# Altium schematic sheet Sheet1.SchDoc
size 594 x 420 mm; Address1: Address1; Address2: Address2; Address3: Address3; Address4: Address4; SheetNumber: 2; Обозначение документа: АБВГ.123456.001 Э3; Наименование организации: ПИКС, гр. 913801; Перв. применение: АБВГ.123456.000; Наименование изделия 1: Плата; Наименование изделия 2: Схема электрическая; Наименование изделия 3: принципиальная; Нач. отд.: Нач. отд.; _List: 1; _Oboznachenie: ГУИР.467649.045 Э2; _Razrabotal: Гончар; _Proveril: Ролич; _Tip_dokumenta: Схема электрическая принципиальная; _Organizaciya2_verhnee: ПИКС, гр. 913801; _Listov: 1; _Nazvanie3_srednee: IP-Видеокамера мобильная
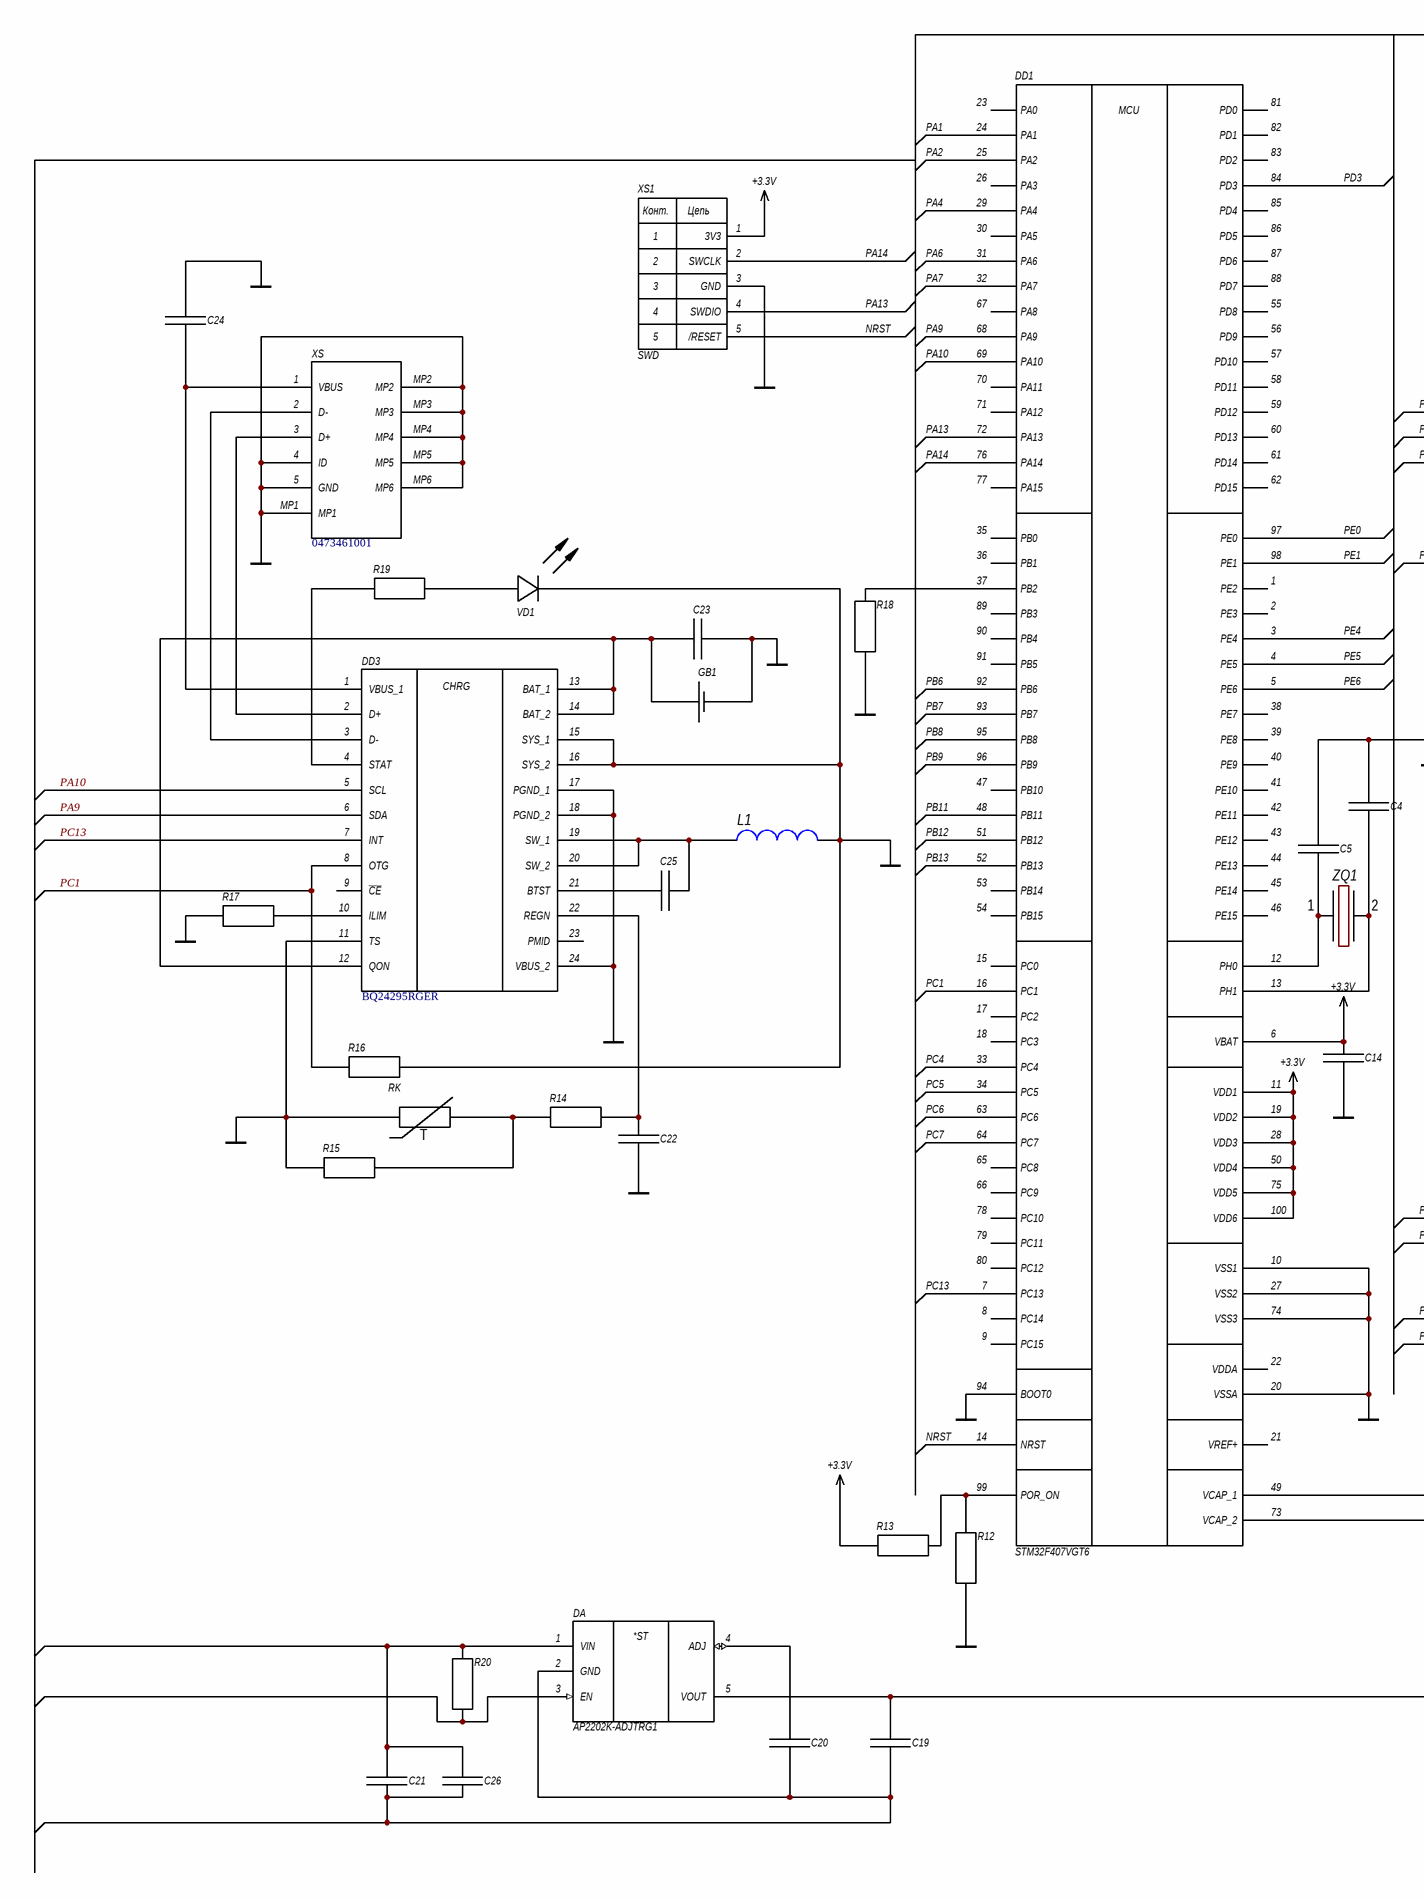
[diagram p0: Sheet1.SchDoc, left]
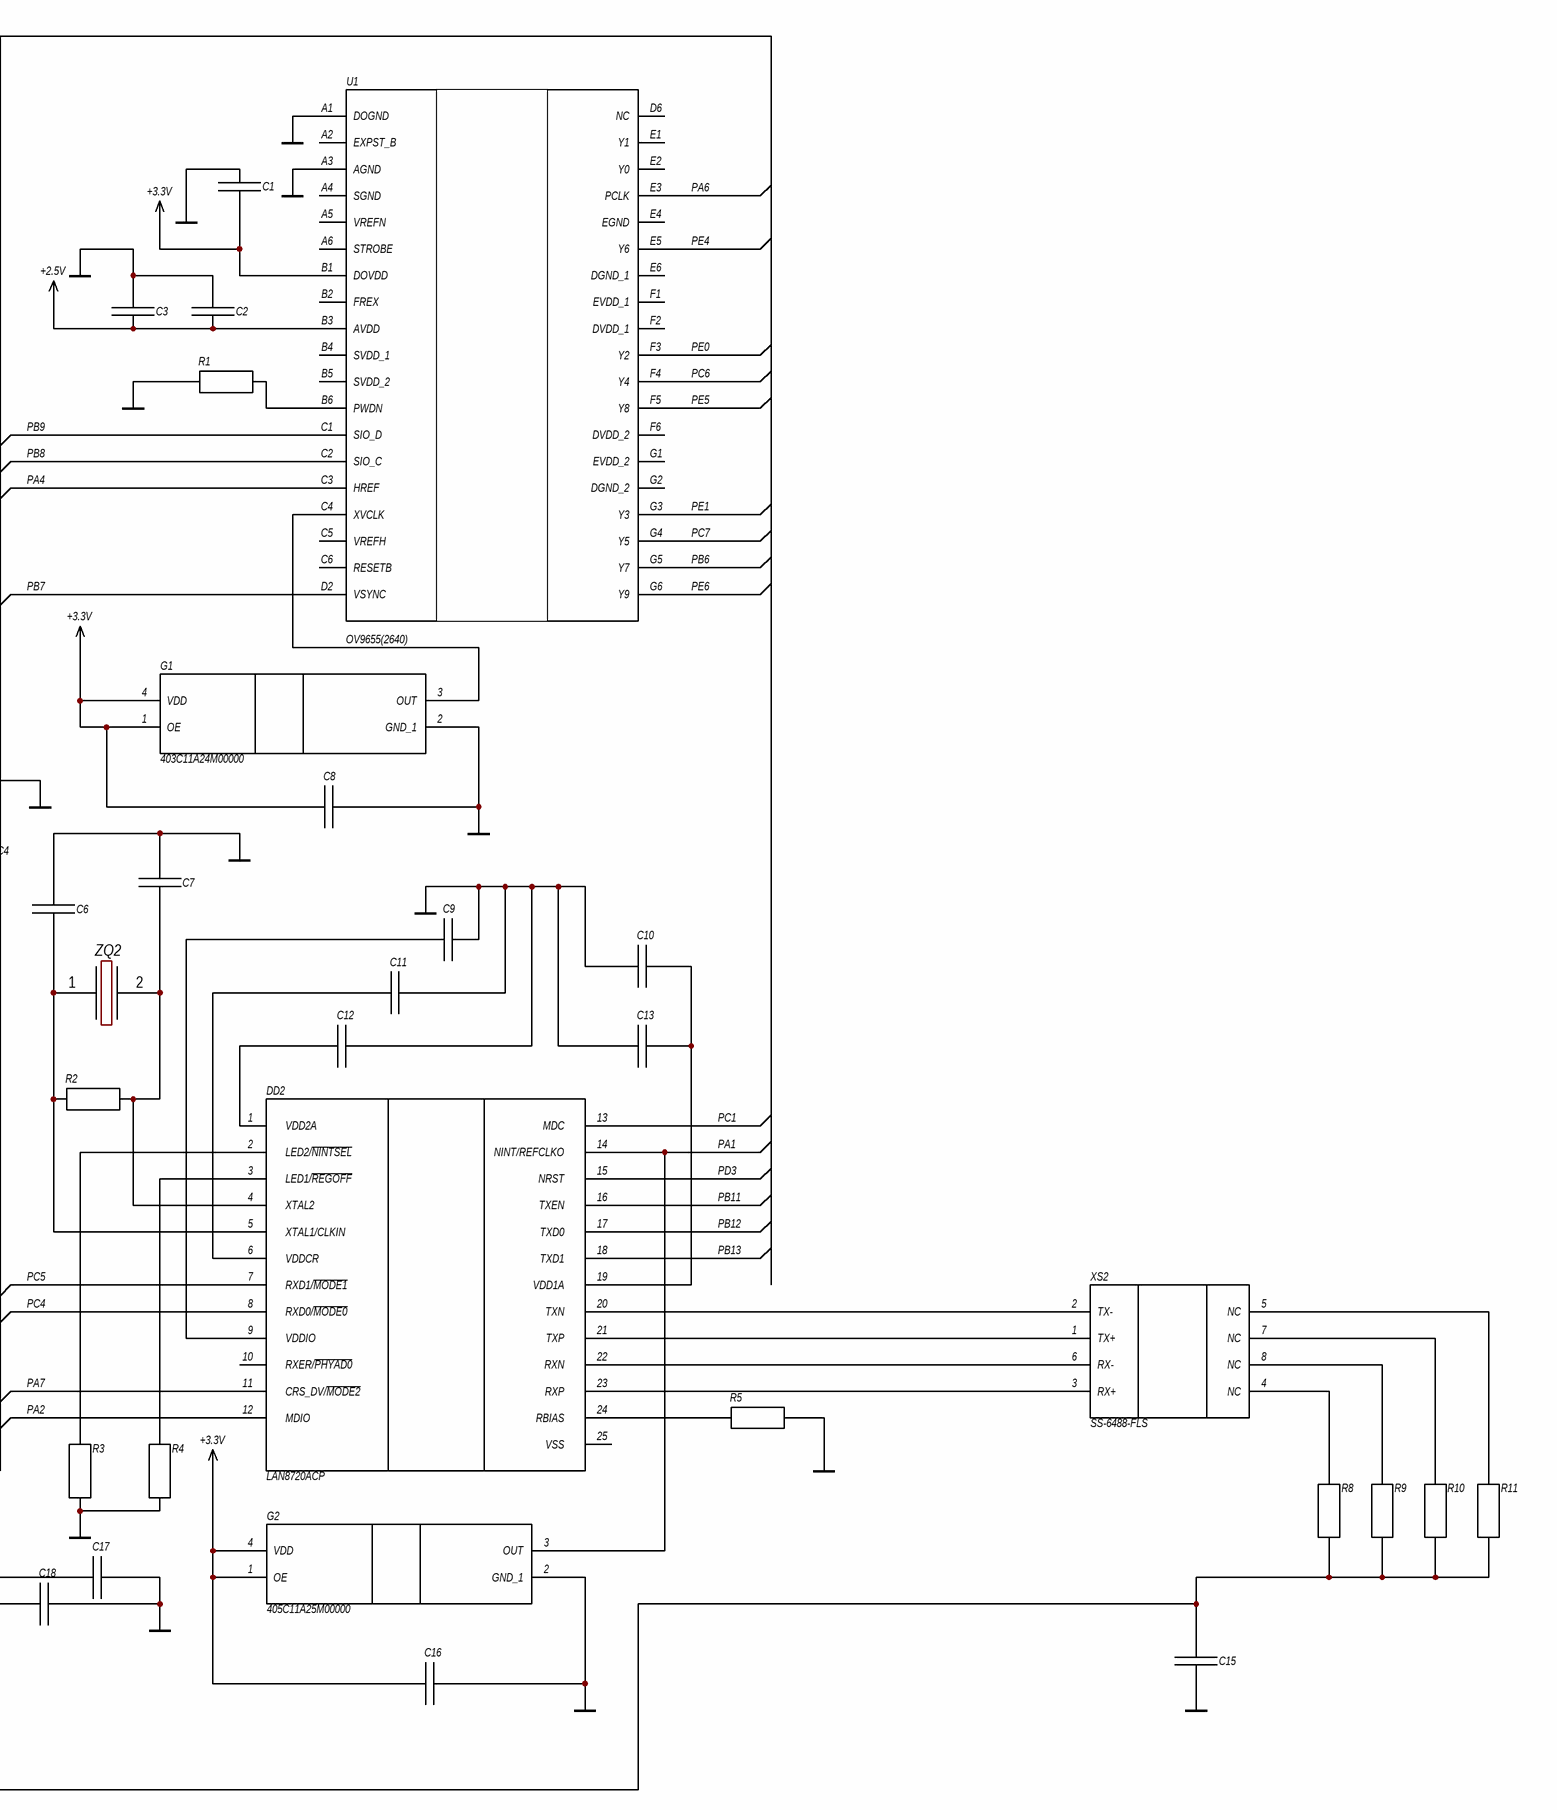
[diagram p1: Sheet1.SchDoc, right]

## Parts
C1  (no value)  [0805 (Capacitor)]
C2  (no value)  [0805 (Capacitor)]
C3  (no value)  [0805 (Capacitor)]
C4  (no value)  [0805 (Capacitor)]
C5  (no value)  [0805 (Capacitor)]
C6  (no value)  [0805 (Capacitor)]
C7  (no value)  [0805 (Capacitor)]
C8  (no value)  [0805 (Capacitor)]
C9  (no value)  [0805 (Capacitor)]
C10  (no value)  [0805 (Capacitor)]
C11  (no value)  [0805 (Capacitor)]
C12  (no value)  [0805 (Capacitor)]
C13  (no value)  [0805 (Capacitor)]
C14  (no value)  [0805 (Capacitor)]
C15  (no value)  [0805 (Capacitor)]
C16  (no value)  [0805 (Capacitor)]
C17  (no value)  [0805 (Capacitor)]
C18  (no value)  [0805 (Capacitor)]
C19  (no value)  [0805 (Capacitor)]
C20  (no value)  [0805 (Capacitor)]
C21  (no value)  [0805 (Capacitor)]
C22  (no value)  [0805 (Capacitor)]
C23  (no value)  [0805 (Capacitor)]
C24  (no value)  [0805 (Capacitor)]
C25  (no value)  [0805 (Capacitor)]
C26  (no value)  [0805 (Capacitor)]
DA  AP2202K-ADJTRG1  [SOT95P280X145-5N]
DD1  STM32F407VGT6  [QFP50P1600X1600X160-100N]
DD2  LAN8720ACP  [QFN50P400X400X100-25N-D]
DD3  BQ24295RGER  [QFN50P400X400X100-25N-D]
G1  403C11A24M00000  [403C11A20M00000]
G2  405C11A25M00000  [405C11A25M00000]
GB1  (no value)  [Battery]
L1  (no value)  [IND: SDR0604]
R1  (no value)  [0805 (Resistor)]
R2  (no value)  [0805 (Resistor)]
R3  (no value)  [0805 (Resistor)]
R4  (no value)  [0805 (Resistor)]
R5  (no value)  [0805 (Resistor)]
R8  (no value)  [0805 (Resistor)]
R9  (no value)  [0805 (Resistor)]
R10  (no value)  [0805 (Resistor)]
R11  (no value)  [0805 (Resistor)]
R12  (no value)  [0805 (Resistor)]
R13  (no value)  [0805 (Resistor)]
R14  (no value)  [0805 (Resistor)]
R15  (no value)  [0805 (Resistor)]
R16  (no value)  [0805 (Resistor)]
R17  (no value)  [0805 (Resistor)]
R18  (no value)  [0805 (Resistor)]
R19  (no value)  [0805 (Resistor)]
R20  (no value)  [0805 (Resistor)]
RK  (no value)  [0805 (Resistor)]
U1  OV9655(2640)  [BGA38C80P6X7_572X628X96]
VD1  (no value)  [LED]
XS  0473461001  [0473461001]
XS1  SWD  [SWD]
XS2  SS-6488-FLS  [SS6488FLS]
ZQ1  (no value)  [OSC: 2016]
ZQ2  (no value)  [OSC: 2016]

## Nets
+2.5V: C2.2 C3.2 U1.B3(AVDD)
+3.3V: C1.2 C8.1 C14.1 C16.1 DD1.6(VBAT) DD1.11(VDD1) DD1.19(VDD2) DD1.28(VDD3) DD1.50(VDD4) DD1.75(VDD5) DD1.100(VDD6) G1.1(OE) G1.4(VDD) G2.1(OE) G2.4(VDD) R13.2 U1.B1(DOVDD) XS1.1(3V3)
GND: C1.1 C2.1 C3.1 C4.1 C5.1 C6.1 C7.1 C8.2 C9.2 C10.1 C11.2 C12.2 C13.1 C14.2 C15.1 C16.2 C17.2 C18.2 C22.2 C23.2 C24.2 DD1.10(VSS1) DD1.20(VSSA) DD1.27(VSS2) DD1.74(VSS3) DD1.94(BOOT0) DD3.11(TS) DD3.15(SYS_1) DD3.16(SYS_2) DD3.17(PGND_1) DD3.18(PGND_2) DD3.24(VBUS_2) G1.2(GND_1) G2.2(GND_1) GB1.2 L1.1 R1.1 R3.1 R4.1 R5.2 R12.1 R15.1 R16.2 R17.1 R18.1 RK.1 U1.A1(DOGND) U1.A3(AGND) VD1.2(C) XS.4(ID) XS.5(GND) XS.MP1 XS.MP2 XS.MP3 XS.MP4 XS.MP5 XS.MP6 XS1.3(GND)
NRST: DD1.14(NRST) XS1.5(/RESET)
PA1: DD1.24(PA1) DD2.14(NINT/REFCLKO) G2.3(OUT)
PA2: DD1.25(PA2) DD2.12(MDIO)
PA4: DD1.29(PA4) U1.C3(HREF)
PA6: DD1.31(PA6) U1.E3(PCLK)
PA7: DD1.32(PA7) DD2.11(CRS_DV/~{MODE2})
PA9: DD1.68(PA9) DD3.6(SDA)
PA10: DD1.69(PA10) DD3.5(SCL)
PA13: DD1.72(PA13) XS1.4(SWDIO)
PA14: DD1.76(PA14) XS1.2(SWCLK)
PB6: DD1.92(PB6) U1.G5(Y7)
PB7: DD1.93(PB7) U1.D2(VSYNC)
PB8: DD1.95(PB8) U1.C2(SIO_C)
PB9: DD1.96(PB9) U1.C1(SIO_D)
PB11: DD1.48(PB11) DD2.16(TXEN)
PB12: DD1.51(PB12) DD2.17(TXD0)
PB13: DD1.52(PB13) DD2.18(TXD1)
PC1: DD1.16(PC1) DD2.13(MDC) DD3.8(OTG) R16.1
PC4: DD1.33(PC4) DD2.8(RXD0/~{MODE0})
PC5: DD1.34(PC5) DD2.7(RXD1/~{MODE1})
PC6: DD1.63(PC6) U1.F4(Y4)
PC7: DD1.64(PC7) U1.G4(Y5)
PC13: DD1.7(PC13) DD3.7(INT)
PD3: DD1.84(PD3) DD2.15(NRST)
PE0: DD1.97(PE0) U1.F3(Y2)
PE1: DD1.98(PE1) U1.G3(Y3)
PE4: DD1.3(PE4) U1.E5(Y6)
PE5: DD1.4(PE5) U1.F5(Y8)
PE6: DD1.5(PE6) U1.G6(Y9)
NetC4_2: C4.2 DD1.13(PH1) ZQ1.2
NetC5_2: C5.2 DD1.12(PH0) ZQ1.1
NetC6_2: C6.2 DD2.5(XTAL1/CLKIN) R2.1 ZQ2.1
NetC7_2: C7.2 DD2.4(XTAL2) R2.2 ZQ2.2
NetC9_1: C9.1 DD2.9(VDDIO)
NetC10_2: C10.2 C13.2 DD2.19(VDD1A)
NetC11_1: C11.1 DD2.6(VDDCR)
NetC12_1: C12.1 DD2.1(VDD2A)
NetC15_2: C15.2 C19.1 DA.5(VOUT) R8.1 R9.1 R10.1 R11.1
NetC17_1: C17.1 DD1.49(VCAP_1)
NetC18_1: C18.1 DD1.73(VCAP_2)
NetC19_2: C19.2 C20.2 C21.1 C26.1 DA.2(GND)
NetC20_1: C20.1 DA.4(ADJ)
NetC21_2: C21.2 C26.2 DA.1(VIN) R20.2
NetC22_1: C22.1 DD3.22(REGN) R14.2
NetC23_1: C23.1 DD3.12(QON) DD3.13(BAT_1) DD3.14(BAT_2) GB1.1
NetC24_1: C24.1 DD3.1(VBUS_1) XS.1(VBUS)
NetC25_1: C25.1 DD3.19(SW_1) DD3.20(SW_2) L1.2
NetC25_2: C25.2 DD3.21(BTST)
NetDA_3: DA.3(EN) R20.1
NetDD1_37: DD1.37(PB2) R18.2
NetDD1_99: DD1.99(POR_ON) R12.2 R13.1
NetDD2_2: DD2.2(LED2/~{NINTSEL}) R3.2
NetDD2_3: DD2.3(LED1/~{REGOFF}) R4.2
NetDD2_20: DD2.20(TXN) XS2.2(TX-)
NetDD2_21: DD2.21(TXP) XS2.1(TX+)
NetDD2_22: DD2.22(RXN) XS2.6(RX-)
NetDD2_23: DD2.23(RXP) XS2.3(RX+)
NetDD2_24: DD2.24(RBIAS) R5.1
NetDD3_2: DD3.2(D+) XS.3(D+)
NetDD3_3: DD3.3(D-) XS.2(D-)
NetDD3_4: DD3.4(STAT) R19.1
NetDD3_10: DD3.10(ILIM) R17.2
NetG1_3: G1.3(OUT) U1.C4(XVCLK)
NetR1_2: R1.2 U1.B6(PWDN)
NetR8_2: R8.2 XS2.4(NC)
NetR9_2: R9.2 XS2.8(NC)
NetR10_2: R10.2 XS2.7(NC)
NetR11_2: R11.2 XS2.5(NC)
NetR14_1: R14.1 R15.2 RK.2
NetR19_2: R19.2 VD1.1(A)

Not connected (* = marked no-connect by the designer): DD1 1(PE2) 2(PE3) 8(PC14) 9(PC15) 15(PC0) 17(PC2) 18(PC3) 21(VREF+) 22(VDDA) 23(PA0) 26(PA3) 30(PA5) 35(PB0) 36(PB1) 38(PE7) 39(PE8) 40(PE9) 41(PE10) 42(PE11) 43(PE12) 44(PE13) 45(PE14) 46(PE15) 47(PB10) 53(PB14) 54(PB15) 55(PD8) 56(PD9) 57(PD10) 58(PD11) 59(PD12) 60(PD13) 61(PD14) 62(PD15) 65(PC8) 66(PC9) 67(PA8) 70(PA11) 71(PA12) 77(PA15) 78(PC10) 79(PC11) 80(PC12) 81(PD0) 82(PD1) 83(PD2) 85(PD4) 86(PD5) 87(PD6) 88(PD7) 89(PB3) 90(PB4) 91(PB5); DD2 10(RXER/~{PHYAD0}) 25(VSS); DD3 9(~{CE}) 23(PMID); U1 A2(EXPST_B) A4(SGND) A5(VREFN) A6(STROBE) B2(FREX) B4(SVDD_1) B5(SVDD_2) C5(VREFH) C6(RESETB) D6(NC) E1(Y1) E2(Y0) E4(EGND) E6(DGND_1) F1(EVDD_1) F2(DVDD_1) F6(DVDD_2) G1(EVDD_2) G2(DGND_2)

## Notes on the sheet
- Перв. примен.
- Справочный №
- Подп. и дата
- Инв. № дубл.
- Взаим. инв. №
- Разраб.
- Изм.
- Лист
- №докум.
- Подп.
- Дата
- Лит.
- Масса
- Масштаб
- Пров.
- Т.контр.
- Листов
- Инв. № подл.
- Н.контр.
- Утв.
- Копировал
- Формат A2
- (in symbol AP2202K-ADJTRG1) *ST
- (in symbol BQ24295RGER) CHRG
- (in symbol Resistor_termo) T
- (in symbol STM32F407VGT6) MCU
- (in symbol SWD) Конт.; Цепь

## Library data of the parts
C1-C26 = Condensator
DA = AP2202K-ADJTRG1: Power Supply; Manufacturer_Name: Diodes Inc.; Datasheet Link: https://datasheet.datasheetarchive.com/originals/distributors/Datasheets_SAMA/e861ef6f8b654668a5f87b1391b432c9.pdf; Height: 1.45mm; Manufacturer_Part_Number: AP2202K-ADJTRG1; Mouser Part Number: 621-AP2202K-ADJTRG1; Mouser Price/Stock: https://www.mouser.co.uk/ProductDetail/Diodes-Incorporated/AP2202K-ADJTRG1/?qs=x6A8l6qLYDCHGTWtscGpkA%3D%3D; Arrow Part Number: AP2202K-ADJTRG1; Arrow Price/Stock: https://www.arrow.com/en/products/ap2202k-adjtrg1/diodes-incorporated
DD1 = STM32F407VGT6: Integrated Circuit; Manufacturer_Name: STMicroelectronics; Datasheet Link: http://www.st.com/web/en/resource/technical/document/datasheet/DM00037051.pdf; Height: 1.6mm; Manufacturer_Part_Number: STM32F407VGT6; Mouser Part Number: 511-STM32F407VGT6; Mouser Price/Stock: https://www.mouser.co.uk/ProductDetail/STMicroelectronics/STM32F407VGT6?qs=Z8%252BeY1k3TIKAEQqwbO%2FOzA%3D%3D; Arrow Part Number: STM32F407VGT6; Arrow Price/Stock: https://www.arrow.com/en/products/stm32f407vgt6/stmicroelectronics?region=nac
DD2 = LAN8720ACP: Integrated Circuit; Manufacturer_Name: Microchip; Datasheet Link: http://ww1.microchip.com/downloads/en/DeviceDoc/8720a.pdf; Height: 1mm; Manufacturer_Part_Number: LAN8720ACP
DD3 = BQ24295RGER: Integrated Circuit; Manufacturer_Name: Texas Instruments; Datasheet Link: http://www.ti.com/lit/ds/symlink/bq24295.pdf; Height: 1mm; Manufacturer_Part_Number: BQ24295RGER; Mouser Part Number: 595-BQ24295RGER; Mouser Price/Stock: https://www.mouser.co.uk/ProductDetail/Texas-Instruments/BQ24295RGER?qs=igp4D3uu33JuaPeRfsSg2w%3D%3D; Arrow Part Number: BQ24295RGER; Arrow Price/Stock: https://www.arrow.com/en/products/bq24295rger/texas-instruments
G1 = 403C11A24M00000: Crystal or Oscillator; Manufacturer_Name: CTS; Datasheet Link: https://datasheet.datasheetarchive.com/originals/dk/DKDS-12/236325.pdf; Height: 0.75mm; Manufacturer_Part_Number: 403C11A24M00000; Mouser Part Number: 774-403C11A24M00000; Mouser Price/Stock: https://www.mouser.co.uk/ProductDetail/CTS-Electronic-Components/403C11A24M00000?qs=9D%2FjjU8ZSZ6G6K4SP5chGw%3D%3D; Arrow Part Number: 403C11A24M00000; Arrow Price/Stock: https://www.arrow.com/en/products/403c11a24m00000/cts
G2 = 405C11A25M00000: Crystal or Oscillator; Manufacturer_Name: CTS; Datasheet Link: https://componentsearchengine.com/Datasheets/1/405C11A25M00000.pdf; Height: 1mm; Manufacturer_Part_Number: 405C11A25M00000; Mouser Part Number: 774-405C11A25M00000; Mouser Price/Stock: https://www.mouser.com/Search/Refine.aspx?Keyword=774-405C11A25M00000; Arrow Part Number: 405C11A25M00000; Arrow Price/Stock: https://www.arrow.com/en/products/405c11a25m00000/cts
GB1 = Battery
L1 = Inductor_0603: Manufacturer: Murata Electronics; PartNumber: LQM18FN100M00D; ValueManufacturerPartNumber: Fixed inductor, , , 0603, 50mA, -55...+125°C; TypeInductor: Fixed inductor; MaxCurrent: 50mA; Package: 0603; HelpURL: https://www.digikey.com/product-detail/en/murata-electronics-north-america/LQM18FN100M00D/490-4025-1-ND/1016285; Temperature: -55...+125°C
R1-R5 R8-R20 = Resistor
RK = Resistor_termo
U1 = OV2640-VL9A: Integrated Circuit; Manufacturer_Name: Omnivision; Datasheet Link: https://www.uctronics.com/download/cam_module/OV2640DS.pdf; Height: 0.965mm; Manufacturer_Part_Number: OV2640-VL9A
VD1 = LED_single: ValueManufacturerPartNumber: LED, Green, *, *, *, -55...+150°C; ColorParameter: Green; Manufacturer: *; Package: *; HelpURL: *; Temperature: -55...+150°C; TypeDiode: LED; Current: *; VoltageDrop: *; PartNumber: *
XS = 0473461001: Connector; Manufacturer_Name: Molex; Datasheet Link: https://componentsearchengine.com/Datasheets/1/0473461001.pdf; Height: 2.45mm; Manufacturer_Part_Number: 0473461001; Mouser Part Number: N/A; Mouser Price/Stock: https://www.mouser.co.uk/ProductDetail/Molex/0473461001?qs=2bnkQPT%252BPafTZgGVt%2FOGfA%3D%3D; Arrow Part Number: 0473461001; Arrow Price/Stock: https://www.arrow.com/en/products/0473461001/molex?region=nac
XS2 = SS-6488-FLS: Connector; Manufacturer_Name: Bel; Datasheet Link: https://www.mouser.com/datasheet/2/643/dr-STW-SS-6488-FLS-1155125.pdf; Height: 11.05mm; Manufacturer_Part_Number: SS-6488-FLS; Mouser Part Number: 530-SS-6488-FLS
ZQ1 ZQ2 = Crystal_2016: Manufacturer: Murata Electronics; PartNumber: XRCGB25M000F0L00R0; ValueManufacturerPartNumber: Crystal, , 6pF, ±50ppm, case 2016, -30...+85°C; LoadCapacitance: 6pF; Tolerance: ±50ppm; Package: case 2016; HelpURL: https://www.digikey.com/product-detail/en/murata-electronics-north-america/XRCGB25M000F0L00R0/490-5577-1-ND/2368391; Temperature: -30...+85°C; TypeOscilator: Crystal